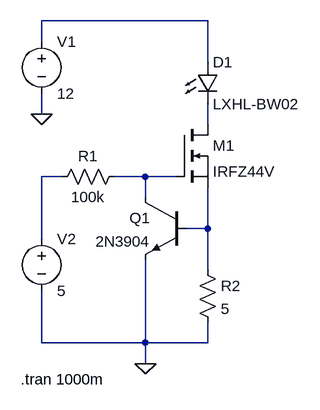
[diagram p0: schematic current_src.asc]
current_src.asc, the LTspice schematic file:
Version 4
SHEET 1 880 680
WIRE 192 64 -64 64
WIRE -64 96 -64 64
WIRE 192 128 192 64
WIRE -64 208 -64 176
WIRE 192 224 192 192
WIRE -32 304 -64 304
WIRE 96 304 48 304
WIRE 144 304 96 304
WIRE 96 336 96 304
WIRE 192 384 192 320
WIRE 192 384 160 384
WIRE -64 400 -64 304
WIRE 192 448 192 384
WIRE -64 560 -64 480
WIRE 96 560 96 432
WIRE 96 560 -64 560
WIRE 192 560 192 528
WIRE 192 560 96 560
WIRE 96 592 96 560
FLAG 96 592 0
FLAG -64 208 0
SYMBOL LED 176 128 R0
SYMATTR InstName D1
SYMATTR Value LXHL-BW02
SYMBOL npn 160 336 M0
SYMATTR InstName Q1
SYMATTR Value 2N3904
SYMBOL res 64 288 R90
WINDOW 0 0 56 VBottom 2
WINDOW 3 32 56 VTop 2
SYMATTR InstName R1
SYMATTR Value 100k
SYMBOL res 176 432 R0
SYMATTR InstName R2
SYMATTR Value 5
SYMBOL voltage -64 80 R0
WINDOW 123 0 0 Left 2
WINDOW 39 24 124 Left 2
SYMATTR InstName V1
SYMATTR Value 12
SYMBOL voltage -64 384 R0
WINDOW 123 0 0 Left 2
WINDOW 39 0 0 Left 2
SYMATTR InstName V2
SYMATTR Value 5
SYMBOL nmos 144 224 R0
SYMATTR InstName M1
SYMATTR Value IRFZ44V
TEXT -96 616 Left 2 !.tran 1000m

The netlist it stands for:
* current_src.asc
D1 N001 N002 LXHL-BW02
Q1 N004 N005 0 0 2N3904
R1 N004 N003 100k
R2 N005 0 5
V1 N001 0 12
V2 N003 0 5
M1 N002 N004 N005 N005 IRFZ44V
.model D D
.lib standard.dio
.model NPN NPN
.model PNP PNP
.lib standard.bjt
.model NMOS NMOS
.model PMOS PMOS
.lib standard.mos
.tran 1000m
.backanno
.end